# Altium project diplomski.PrjPcb
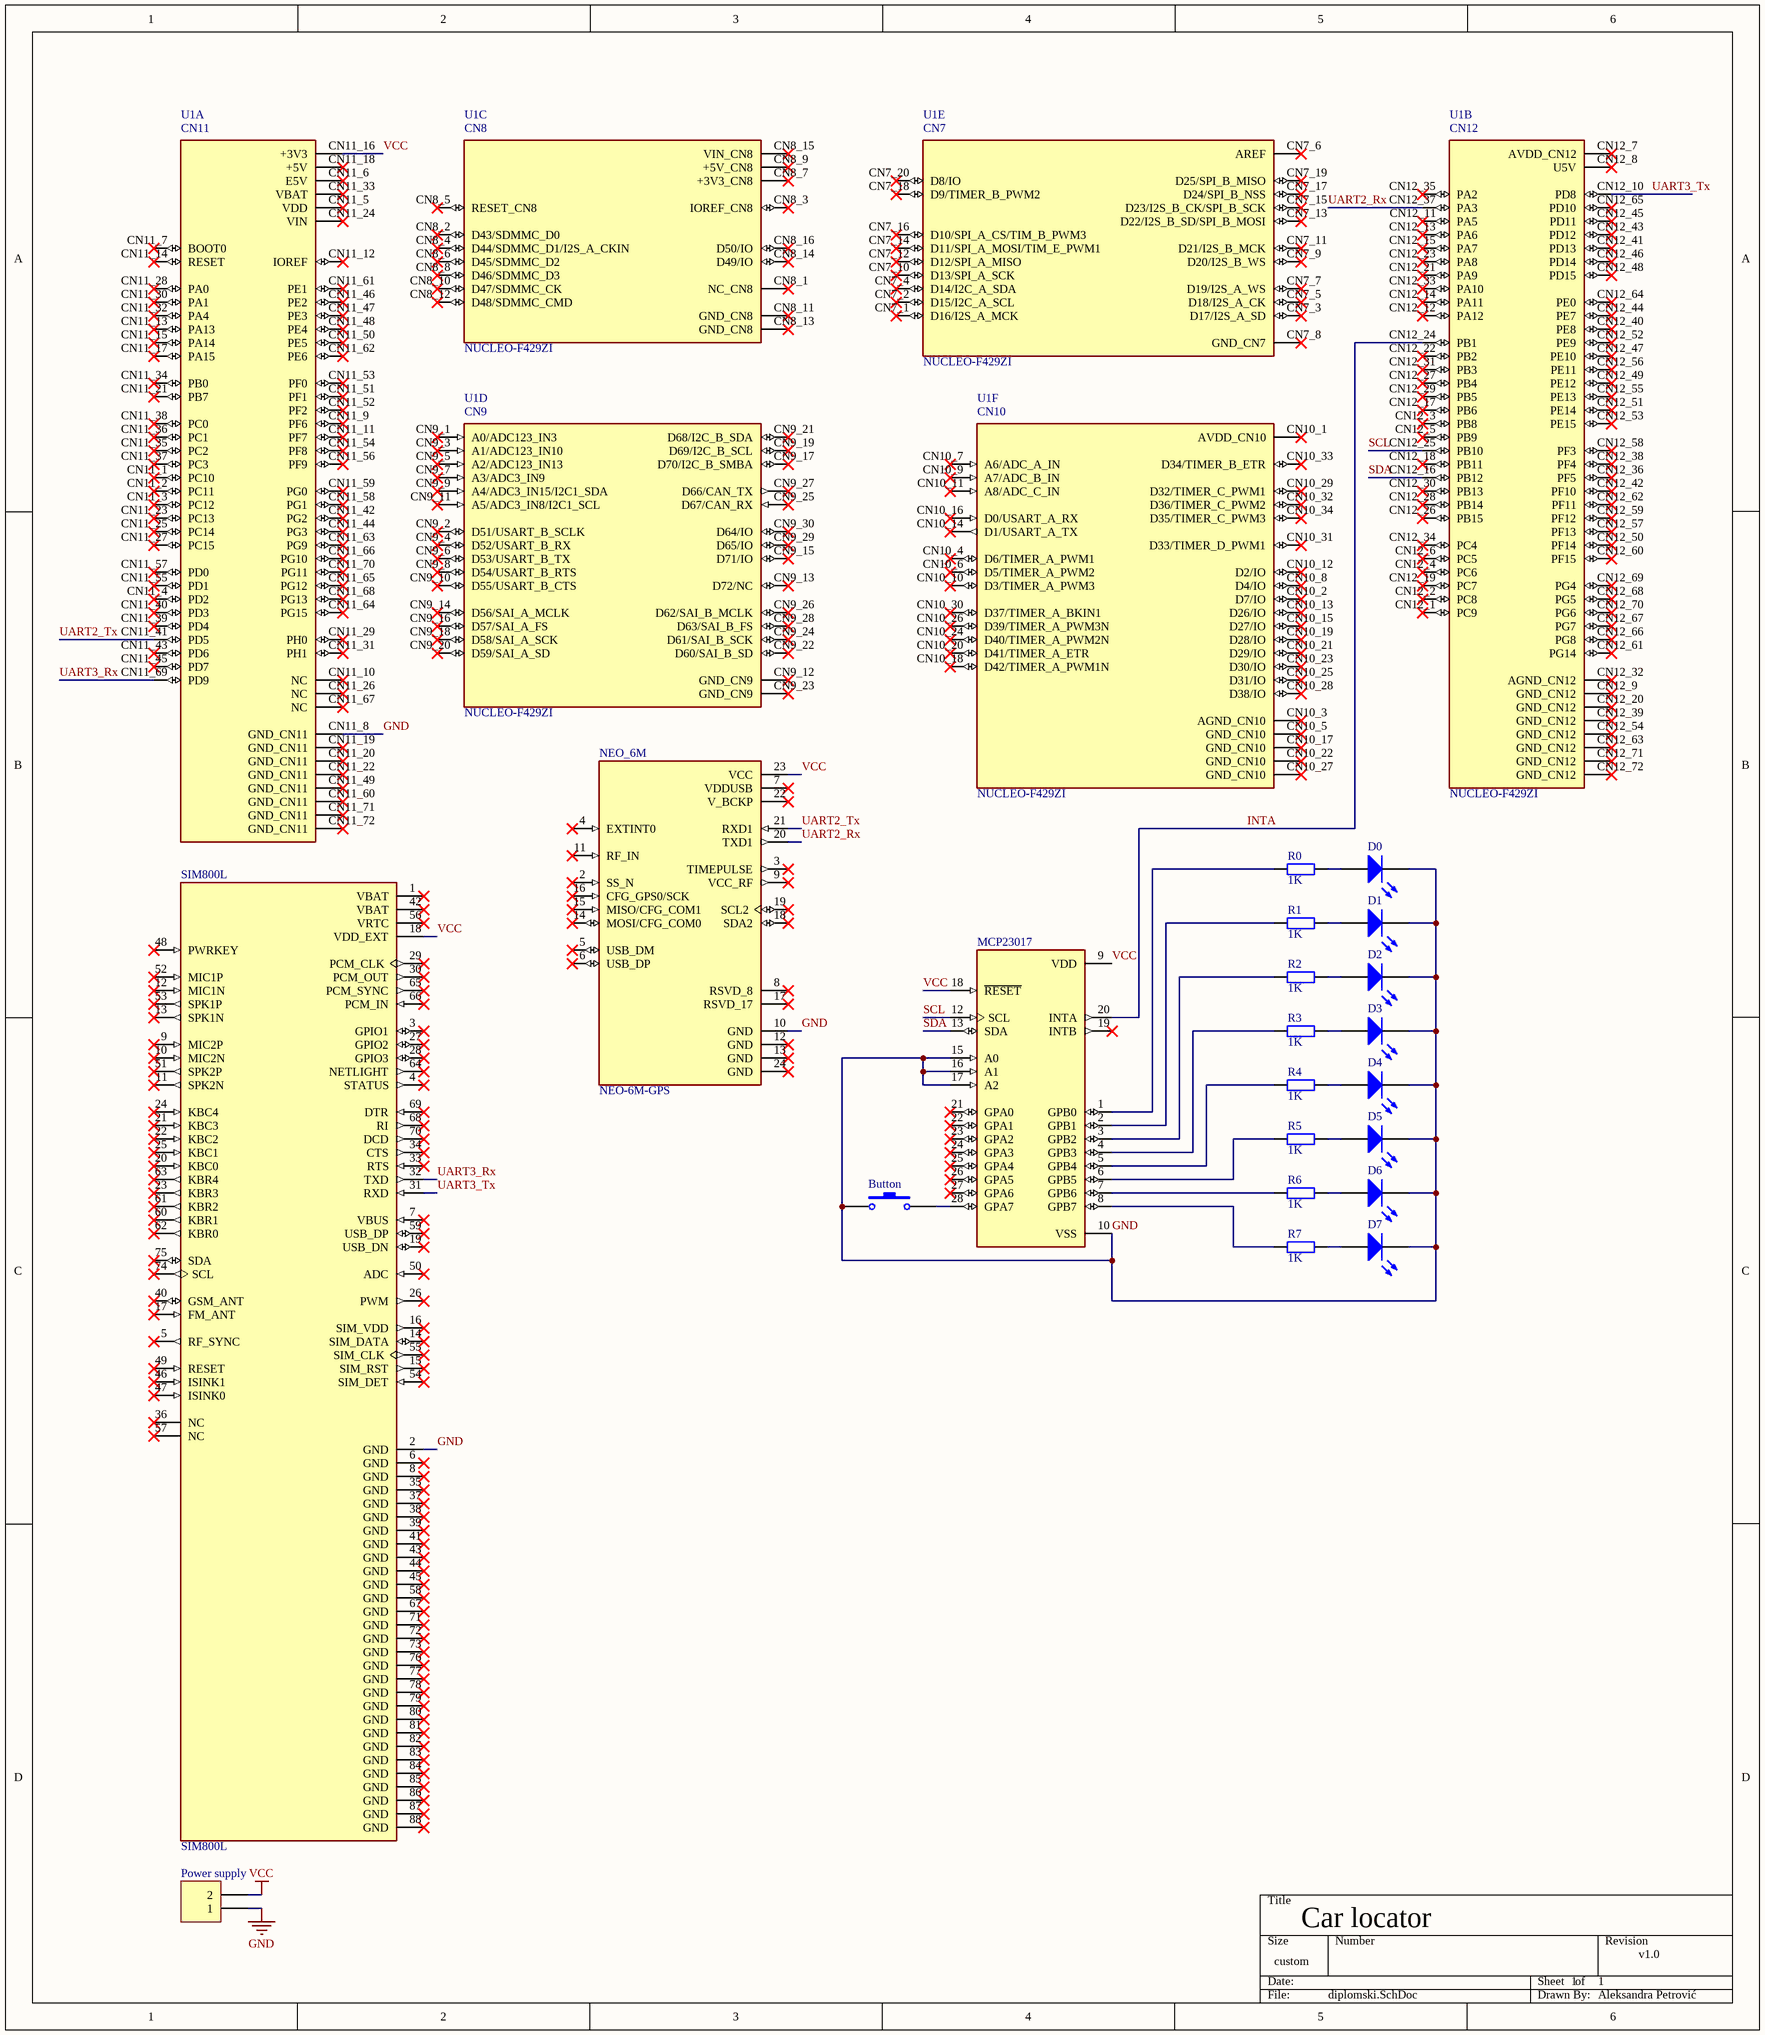
[diagram p0: diplomski.SchDoc]
1 sheet, 22 parts. Net scope: global (net labels, ports and power ports of the same name join across sheets).
Board file: diplomski.PcbDoc

## Sheet diplomski.SchDoc: Diplomski rad
size 330 x 381 mm; DrawnBy: Aleksandra Petrović; SheetNumber: 1; SheetTotal: 1; ProjectName: Diplomski rad

### Parts
Button  SW-PB  [SPST-2]  (value not drawn)
D0  LED0  [LED-0]  (value not drawn)
D1  LED0  [LED-0]  (value not drawn)
D2  LED0  [LED-0]  (value not drawn)
D3  LED0  [LED-0]  (value not drawn)
D4  LED0  [LED-0]  (value not drawn)
D5  LED0  [LED-0]  (value not drawn)
D6  LED0  [LED-0]  (value not drawn)
D7  LED0  [LED-0]  (value not drawn)
MCP23017  MCP23017-E/SP  [DIP787W45P254L3556H508Q28]  (value not drawn)
NEO_6M  NEO-6M-GPS  [XCVR_NEO-6M-GPS]
Power_supply  Header 2  [HDR1X2]  (value not drawn)
R0  value 1K  [AXIAL-0.4]  (hidden comment: Res2)
R1  value 1K  [AXIAL-0.4]  (hidden comment: Res2)
R2  value 1K  [AXIAL-0.4]  (hidden comment: Res2)
R3  value 1K  [AXIAL-0.4]  (hidden comment: Res2)
R4  value 1K  [AXIAL-0.4]  (hidden comment: Res2)
R5  value 1K  [AXIAL-0.4]  (hidden comment: Res2)
R6  value 1K  [AXIAL-0.4]  (hidden comment: Res2)
R7  value 1K  [AXIAL-0.4]  (hidden comment: Res2)
SIM800L  SIM800L  [MODULE_SIM800L]
U1  NUCLEO-F429ZI  [MODULE_NUCLEO-F429ZI]  (value not drawn)  (parts A,B,C,D,E,F of 6)

### Nets
GND: Button.1 D0.2(K) D1.2(K) D2.2(K) D3.2(K) D4.2(K) D5.2(K) D6.2(K) D7.2(K) MCP23017.10(VSS) MCP23017.15(A0) MCP23017.16(A1) MCP23017.17(A2) NEO_6M.10(GND) Power_supply.1 SIM800L.2(GND) U1.CN11_8(GND_CN11)
VCC: MCP23017.9(VDD) MCP23017.18(~{RESET}) NEO_6M.23(VCC) Power_supply.2 SIM800L.18(VDD_EXT) U1.CN11_16(+3V3)
INTA: MCP23017.20(INTA) U1.CN12_24(PB1)
SCL: MCP23017.12(SCL) U1.CN12_25(PB10)
SDA: MCP23017.13(SDA) U1.CN12_16(PB12)
UART2_Rx: NEO_6M.20(TXD1) U1.CN12_37(PA3)
UART2_Tx: NEO_6M.21(RXD1) U1.CN11_41(PD5)
UART3_Rx: SIM800L.32(TXD) U1.CN11_69(PD9)
UART3_Tx: SIM800L.31(RXD) U1.CN12_10(PD8)
NetButton_2: Button.2 MCP23017.28(GPA7)
NetD0_1: D0.1(A) R0.1
NetD1_1: D1.1(A) R1.1
NetD2_1: D2.1(A) R2.1
NetD3_1: D3.1(A) R3.1
NetD4_1: D4.1(A) R4.1
NetD5_1: D5.1(A) R5.1
NetD6_1: D6.1(A) R6.1
NetD7_1: D7.1(A) R7.1
NetMCP23017_1: MCP23017.1(GPB0) R0.2
NetMCP23017_2: MCP23017.2(GPB1) R1.2
NetMCP23017_3: MCP23017.3(GPB2) R2.2
NetMCP23017_4: MCP23017.4(GPB3) R3.2
NetMCP23017_5: MCP23017.5(GPB4) R4.2
NetMCP23017_6: MCP23017.6(GPB5) R5.2
NetMCP23017_7: MCP23017.7(GPB6) R6.2
NetMCP23017_8: MCP23017.8(GPB7) R7.2

Not connected (* = marked no-connect by the designer): MCP23017 19(INTB)* 21(GPA0)* 22(GPA1)* 23(GPA2)* 24(GPA3)* 25(GPA4)* 26(GPA5)* 27(GPA6)*; NEO_6M 2(SS_N)* 3(TIMEPULSE)* 4(EXTINT0)* 5(USB_DM)* 6(USB_DP)* 7(VDDUSB)* 8(RSVD_8)* 9(VCC_RF)* 11(RF_IN)* 12(GND)* 13(GND)* 14(MOSI/CFG_COM0)* 15(MISO/CFG_COM1)* 16(CFG_GPS0/SCK)* 17(RSVD_17)* 18(SDA2)* 19(SCL2)* 22(V_BCKP)* 24(GND)*; SIM800L 1(VBAT)* 3(GPIO1)* 4(STATUS)* 5(RF_SYNC)* 6(GND)* 7(VBUS)* 8(GND)* 9(MIC2P)* 10(MIC2N)* 11(SPK2N)* 12(MIC1N)* 13(SPK1N)* 14(SIM_DATA)* 15(SIM_RST)* 16(SIM_VDD)* 17(FM_ANT)* 19(USB_DN)* 20(KBC0)* 21(KBC3)* 22(KBC2)* 23(KBR3)* 24(KBC4)* 25(KBC1)* 26(PWM)* 27(GPIO2)* 28(GPIO3)* 29(PCM_CLK)* 30(PCM_OUT)* 33(RTS)* 34(CTS)* 35(GND)* 36(NC)* 37(GND)* 38(GND)* 39(GND)* 40(GSM_ANT)* 41(GND)* 42(VBAT)* 43(GND)* 44(GND)* 45(GND)* 46(ISINK1)* 47(ISINK0)* 48(PWRKEY)* 49(RESET)* 50(ADC)* 51(SPK2P)* 52(MIC1P)* 53(SPK1P)* 54(SIM_DET)* 55(SIM_CLK)* 56(VRTC)* 57(NC)* 58(GND)* 59(USB_DP)* 60(KBR1)* 61(KBR2)* 62(KBR0)* 63(KBR4)* 64(NETLIGHT)* 65(PCM_SYNC)* 66(PCM_IN)* 67(GND)* 68(RI)* 69(DTR)* 70(DCD)* 71(GND)* 72(GND)* 73(GND)* 74(SCL)* 75(SDA)* 76(GND)* 77(GND)* 78(GND)* 79(GND)* 80(GND)* 81(GND)* 82(GND)* 83(GND)* 84(GND)* 85(GND)* 86(GND)* 87(GND)* 88(GND)*; U1 CN7_1(D16/I2S_A_MCK)* CN7_2(D15/I2C_A_SCL)* CN7_3(D17/I2S_A_SD)* CN7_4(D14/I2C_A_SDA)* CN7_5(D18/I2S_A_CK)* CN7_6(AREF)* CN7_7(D19/I2S_A_WS)* CN7_8(GND_CN7)* CN7_9(D20/I2S_B_WS)* CN7_10(D13/SPI_A_SCK)* CN7_11(D21/I2S_B_MCK)* CN7_12(D12/SPI_A_MISO)* CN7_13(D22/I2S_B_SD/SPI_B_MOSI)* CN7_14(D11/SPI_A_MOSI/TIM_E_PWM1)* CN7_15(D23/I2S_B_CK/SPI_B_SCK)* CN7_16(D10/SPI_A_CS/TIM_B_PWM3)* CN7_17(D24/SPI_B_NSS)* CN7_18(D9/TIMER_B_PWM2)* CN7_19(D25/SPI_B_MISO)* CN7_20(D8/IO)* CN8_1(NC_CN8)* CN8_2(D43/SDMMC_D0)* CN8_3(IOREF_CN8)* CN8_4(D44/SDMMC_D1/I2S_A_CKIN)* CN8_5(RESET_CN8)* CN8_6(D45/SDMMC_D2)* CN8_7(+3V3_CN8)* CN8_8(D46/SDMMC_D3)* CN8_9(+5V_CN8)* CN8_10(D47/SDMMC_CK)* CN8_11(GND_CN8)* CN8_12(D48/SDMMC_CMD)* CN8_13(GND_CN8)* CN8_14(D49/IO)* CN8_15(VIN_CN8)* CN8_16(D50/IO)* CN9_1(A0/ADC123_IN3)* CN9_2(D51/USART_B_SCLK)* CN9_3(A1/ADC123_IN10)* CN9_4(D52/USART_B_RX)* CN9_5(A2/ADC123_IN13)* CN9_6(D53/USART_B_TX)* CN9_7(A3/ADC3_IN9)* CN9_8(D54/USART_B_RTS)* CN9_9(A4/ADC3_IN15/I2C1_SDA)* CN9_10(D55/USART_B_CTS)* CN9_11(A5/ADC3_IN8/I2C1_SCL)* CN9_12(GND_CN9)* CN9_13(D72/NC)* CN9_14(D56/SAI_A_MCLK)* CN9_15(D71/IO)* CN9_16(D57/SAI_A_FS)* CN9_17(D70/I2C_B_SMBA)* CN9_18(D58/SAI_A_SCK)* CN9_19(D69/I2C_B_SCL)* CN9_20(D59/SAI_A_SD)* CN9_21(D68/I2C_B_SDA)* CN9_22(D60/SAI_B_SD)* CN9_23(GND_CN9)* CN9_24(D61/SAI_B_SCK)* CN9_25(D67/CAN_RX)* CN9_26(D62/SAI_B_MCLK)* CN9_27(D66/CAN_TX)* CN9_28(D63/SAI_B_FS)* CN9_29(D65/IO)* CN9_30(D64/IO)* CN10_1(AVDD_CN10)* CN10_2(D7/IO)* CN10_3(AGND_CN10)* CN10_4(D6/TIMER_A_PWM1)* CN10_5(GND_CN10)* CN10_6(D5/TIMER_A_PWM2)* CN10_7(A6/ADC_A_IN)* CN10_8(D4/IO)* CN10_9(A7/ADC_B_IN)* CN10_10(D3/TIMER_A_PWM3)* CN10_11(A8/ADC_C_IN)* CN10_12(D2/IO)* CN10_13(D26/IO)* CN10_14(D1/USART_A_TX)* CN10_15(D27/IO)* CN10_16(D0/USART_A_RX)* CN10_17(GND_CN10)* CN10_18(D42/TIMER_A_PWM1N)* CN10_19(D28/IO)* CN10_20(D41/TIMER_A_ETR)* CN10_21(D29/IO)* CN10_22(GND_CN10)* CN10_23(D30/IO)* CN10_24(D40/TIMER_A_PWM2N)* CN10_25(D31/IO)* CN10_26(D39/TIMER_A_PWM3N)* CN10_27(GND_CN10)* CN10_28(D38/IO)* CN10_29(D32/TIMER_C_PWM1)* CN10_30(D37/TIMER_A_BKIN1)* CN10_31(D33/TIMER_D_PWM1)* CN10_32(D36/TIMER_C_PWM2)* CN10_33(D34/TIMER_B_ETR)* CN10_34(D35/TIMER_C_PWM3)* CN11_1(PC10)* CN11_2(PC11)* CN11_3(PC12)* CN11_4(PD2)* CN11_5(VDD)* CN11_6(E5V)* CN11_7(BOOT0)* CN11_9(PF6)* CN11_10(NC)* CN11_11(PF7)* CN11_12(IOREF)* CN11_13(PA13)* CN11_14(RESET)* CN11_15(PA14)* CN11_17(PA15)* CN11_18(+5V)* CN11_19(GND_CN11)* CN11_20(GND_CN11)* CN11_21(PB7)* CN11_22(GND_CN11)* CN11_23(PC13)* CN11_24(VIN)* CN11_25(PC14)* CN11_26(NC)* CN11_27(PC15)* CN11_28(PA0)* CN11_29(PH0)* CN11_30(PA1)* CN11_31(PH1)* CN11_32(PA4)* CN11_33(VBAT)* CN11_34(PB0)* CN11_35(PC2)* CN11_36(PC1)* CN11_37(PC3)* CN11_38(PC0)* CN11_39(PD4)* CN11_40(PD3)* CN11_42(PG2)* CN11_43(PD6)* CN11_44(PG3)* CN11_45(PD7)* CN11_46(PE2)* CN11_47(PE3)* CN11_48(PE4)* CN11_49(GND_CN11)* CN11_50(PE5)* CN11_51(PF1)* CN11_52(PF2)* CN11_53(PF0)* CN11_54(PF8)* CN11_55(PD1)* CN11_56(PF9)* CN11_57(PD0)* CN11_58(PG1)* CN11_59(PG0)* CN11_60(GND_CN11)* CN11_61(PE1)* CN11_62(PE6)* CN11_63(PG9)* CN11_64(PG15)* CN11_65(PG12)* CN11_66(PG10)* CN11_67(NC)* CN11_68(PG13)* CN11_70(PG11)* CN11_71(GND_CN11)* CN11_72(GND_CN11)* CN12_1(PC9)* CN12_2(PC8)* CN12_3(PB8)* CN12_4(PC6)* CN12_5(PB9)* CN12_6(PC5)* CN12_7(AVDD_CN12)* CN12_8(U5V)* CN12_9(GND_CN12)* CN12_11(PA5)* CN12_12(PA12)* CN12_13(PA6)* CN12_14(PA11)* CN12_15(PA7)* CN12_17(PB6)* CN12_18(PB11)* CN12_19(PC7)* CN12_20(GND_CN12)* CN12_21(PA9)* CN12_22(PB2)* CN12_23(PA8)* CN12_26(PB15)* CN12_27(PB4)* CN12_28(PB14)* CN12_29(PB5)* CN12_30(PB13)* CN12_31(PB3)* CN12_32(AGND_CN12)* CN12_33(PA10)* CN12_34(PC4)* CN12_35(PA2)* CN12_36(PF5)* CN12_38(PF4)* CN12_39(GND_CN12)* CN12_40(PE8)* CN12_41(PD13)* CN12_42(PF10)* CN12_43(PD12)* CN12_44(PE7)* CN12_45(PD11)* CN12_46(PD14)* CN12_47(PE10)* CN12_48(PD15)* CN12_49(PE12)* CN12_50(PF14)* CN12_51(PE14)* CN12_52(PE9)* CN12_53(PE15)* CN12_54(GND_CN12)* CN12_55(PE13)* CN12_56(PE11)* CN12_57(PF13)* CN12_58(PF3)* CN12_59(PF12)* CN12_60(PF15)* CN12_61(PG14)* CN12_62(PF11)* CN12_63(GND_CN12)* CN12_64(PE0)* CN12_65(PD10)* CN12_66(PG8)* CN12_67(PG7)* CN12_68(PG5)* CN12_69(PG4)* CN12_70(PG6)* CN12_71(GND_CN12)* CN12_72(GND_CN12)*

### Notes on the sheet
- Car locator
- 1
- v1.0
- Aleksandra Petrović
- (in symbol NUCLEO-F429ZI, part A) CN11
- (in symbol NUCLEO-F429ZI, part B) CN12
- (in symbol NUCLEO-F429ZI, part C) CN8
- (in symbol NUCLEO-F429ZI, part D) CN9
- (in symbol NUCLEO-F429ZI, part E) CN7
- (in symbol NUCLEO-F429ZI, part F) CN10

### Library data of the parts
Button = SW-PB: Switch; Published: 24-Mar-1999; LatestRevisionDate: 17-Jul-2002; LatestRevisionNote: Re-released for DXP Platform.; PackageReference: SPST-2; Publisher: Altium Limited; PackageDescription: Switch; 2 Leads
D0-D7 = LED0: Typical INFRARED GaAs LED; Published: 8-Jun-2000; LatestRevisionDate: 08-Jul-2005; LatestRevisionNote: Mech Layer 1 removed.; PackageReference: LED-0; Publisher: Altium Limited; PackageDescription: LED; 2 Leads
MCP23017 = MCP23017-E/SP: I/O Expander 16 IÂ²C 1.7 MHz 28-SPDIP; MF: Microchip; Purchase-URL: https://pricing.snapeda.com/search/part/MCP23017-E/SP/?ref=eda; Price: None; SnapEDA_Link: https://www.snapeda.com/parts/MCP23017-E/SP/Microchip/view-part/?ref=snap; Check_prices: https://www.snapeda.com/parts/MCP23017-E/SP/Microchip/view-part/?ref=eda; Package: DIP-28 Microchip; Availability: In Stock; Value: *; MP: MCP23017-E/SP
NEO_6M = NEO-6M-GPS: GPS Development Tools SparkFun GNSS-RTK Dead Reckoning Breakout - ZED-F9K (Qwiic); MF: u-blox; SnapEDA_Link: https://www.snapeda.com/parts/NEO-6M-GPS/u-blox/view-part/?ref=snap; MP: NEO-6M-GPS; Availability: Not in stock; Price: None; Check_prices: https://www.snapeda.com/parts/NEO-6M-GPS/u-blox/view-part/?ref=eda; Value: *; Package: None
Power_supply = Header 2: Header, 2-Pin; LatestRevisionDate: 17-Jul-2002; LatestRevisionNote: Re-released for DXP Platform.; Publisher: Altium Limited
R0-R7 = Res2: Resistor; Published: 8-Jun-2000; LatestRevisionDate: 17-Jul-2002; LatestRevisionNote: Re-released for DXP Platform.; PackageReference: AXIAL-0.4; Publisher: Altium Limited; PackageDescription: Axial Device, Thru-Hole; 2 Leads; 0.4 in Pin Spacing
SIM800L = SIM800L: SIM800L GSM RF M5Stack Platform Evaluation Expansion Board; MF: Simcom; Availability: Not in stock; MP: SIM800L; Check_prices: https://www.snapeda.com/parts/SIM800L/SIMcom+Wireless+solutions+Co.%252CLtd/view-part/?ref=eda; Value: *; SnapEDA_Link: https://www.snapeda.com/parts/SIM800L/SIMcom+Wireless+solutions+Co.%252CLtd/view-part/?ref=snap; Price: None; Package: None
U1 = NUCLEO-F429ZI: STM32F429ZI, mbed-Enabled Development Nucleo-144 STM32F4 ARMÂ® CortexÂ®-M4 MCU 32-Bit Embedded Evaluation Board; MF: STMicroelectronics; Value: *; SnapEDA_Link: https://www.snapeda.com/parts/NUCLEO-F429ZI/STMicroelectronics/view-part/?ref=snap; MP: NUCLEO-F429ZI; Purchase-URL: https://pricing.snapeda.com/search/part/NUCLEO-F429ZI/?ref=eda; Check_prices: https://www.snapeda.com/parts/NUCLEO-F429ZI/STMicroelectronics/view-part/?ref=eda; Availability: In Stock; Price: None; Package: None